# EAGLE design bridge_rp_dlp (EAGLE 9.6.2)
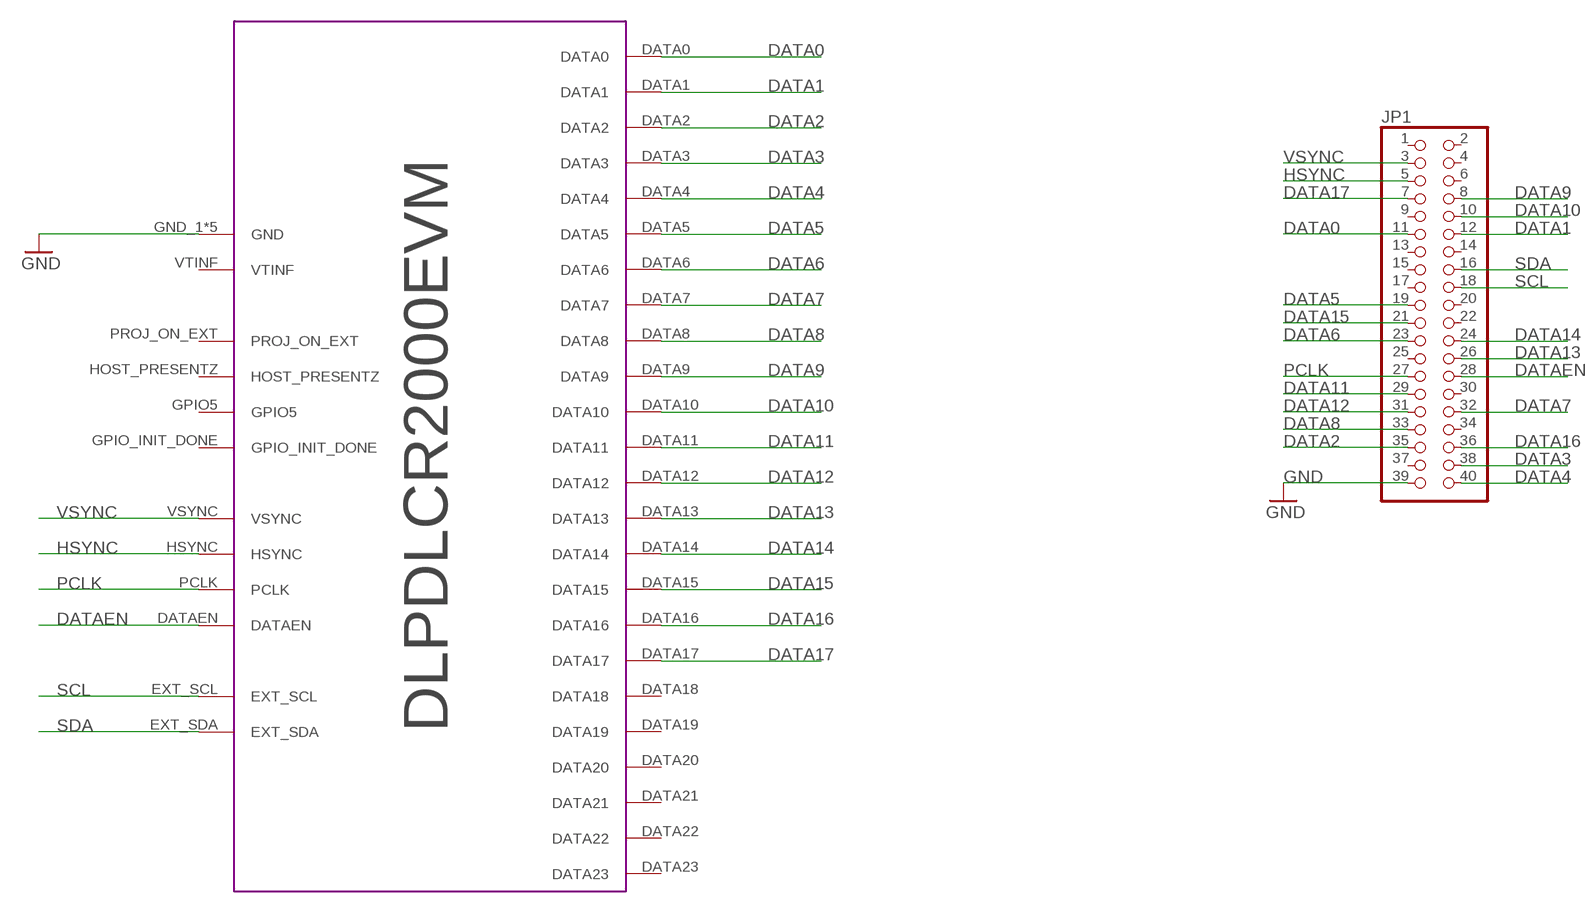
[diagram p0: schematic, sheet 1]

## Parts
JP1  PINHD-2X20  [2X20]
U$1  DLPDLCR2000EVM  [DLPDLCR2000EVM]

## Nets
DATA0: JP1.11 U$1.DATA0
DATA1: JP1.12 U$1.DATA1
DATA2: JP1.35 U$1.DATA2
DATA3: JP1.38 U$1.DATA3
DATA4: JP1.40 U$1.DATA4
DATA5: JP1.19 U$1.DATA5
DATA6: JP1.23 U$1.DATA6
DATA7: JP1.32 U$1.DATA7
DATA8: JP1.33 U$1.DATA8
DATA9: JP1.8 U$1.DATA9
DATA10: JP1.10 U$1.DATA10
DATA11: JP1.29 U$1.DATA11
DATA12: JP1.31 U$1.DATA12
DATA13: JP1.26 U$1.DATA13
DATA14: JP1.24 U$1.DATA14
DATA15: JP1.21 U$1.DATA15
DATA16: JP1.36 U$1.DATA16
DATA17: JP1.7 U$1.DATA17
DATAEN: JP1.28 U$1.DATAEN
GND: JP1.39 U$1.GND_1(GND) U$1.GND_2(GND) U$1.GND_3(GND) U$1.GND_4(GND) U$1.GND_5(GND)
HSYNC: JP1.5 U$1.HSYNC
PCLK: JP1.27 U$1.PCLK
SCL: JP1.18 U$1.EXT_SCL
SDA: JP1.16 U$1.EXT_SDA
VSYNC: JP1.3 U$1.VSYNC
Unconnected: JP1.1 JP1.2 JP1.4 JP1.6 JP1.9 JP1.13 JP1.14 JP1.15 JP1.17 JP1.20 JP1.22 JP1.25 JP1.30 JP1.34 JP1.37 U$1.DATA18 U$1.DATA19 U$1.DATA20 U$1.DATA21 U$1.DATA22 U$1.DATA23 U$1.GPIO5 U$1.GPIO_INIT_DONE U$1.HOST_PRESENTZ U$1.PROJ_ON_EXT U$1.VTINF

## Library data of the parts
JP1 = pinhead:PINHD-2X20: PIN HEADER
U$1 = DLP_lib:DLPDLCR2000EVM: The DLP® LightCrafter Display 2000 Evaluation Module (EVM) is the most affordable, compact, plug-and-play DLP display EVM for many ultra-mobile, ultra-portable display applications like mobile projectors, smart home displays, AR glasses, appliances, and robotics. This EVM features the DLP2000 (nHD) chipset, optical engine (which can be purchased separately here), and 8/16/24-bit RGB parallel video processor interface. Visit DLPDLCR230NPEVM for a higher performance EVM option that features 1080p resolution, 100lm, and Raspberry Pi out of the box. https://www.ti.com/tool/DLPDLCR2000EVM

## Board
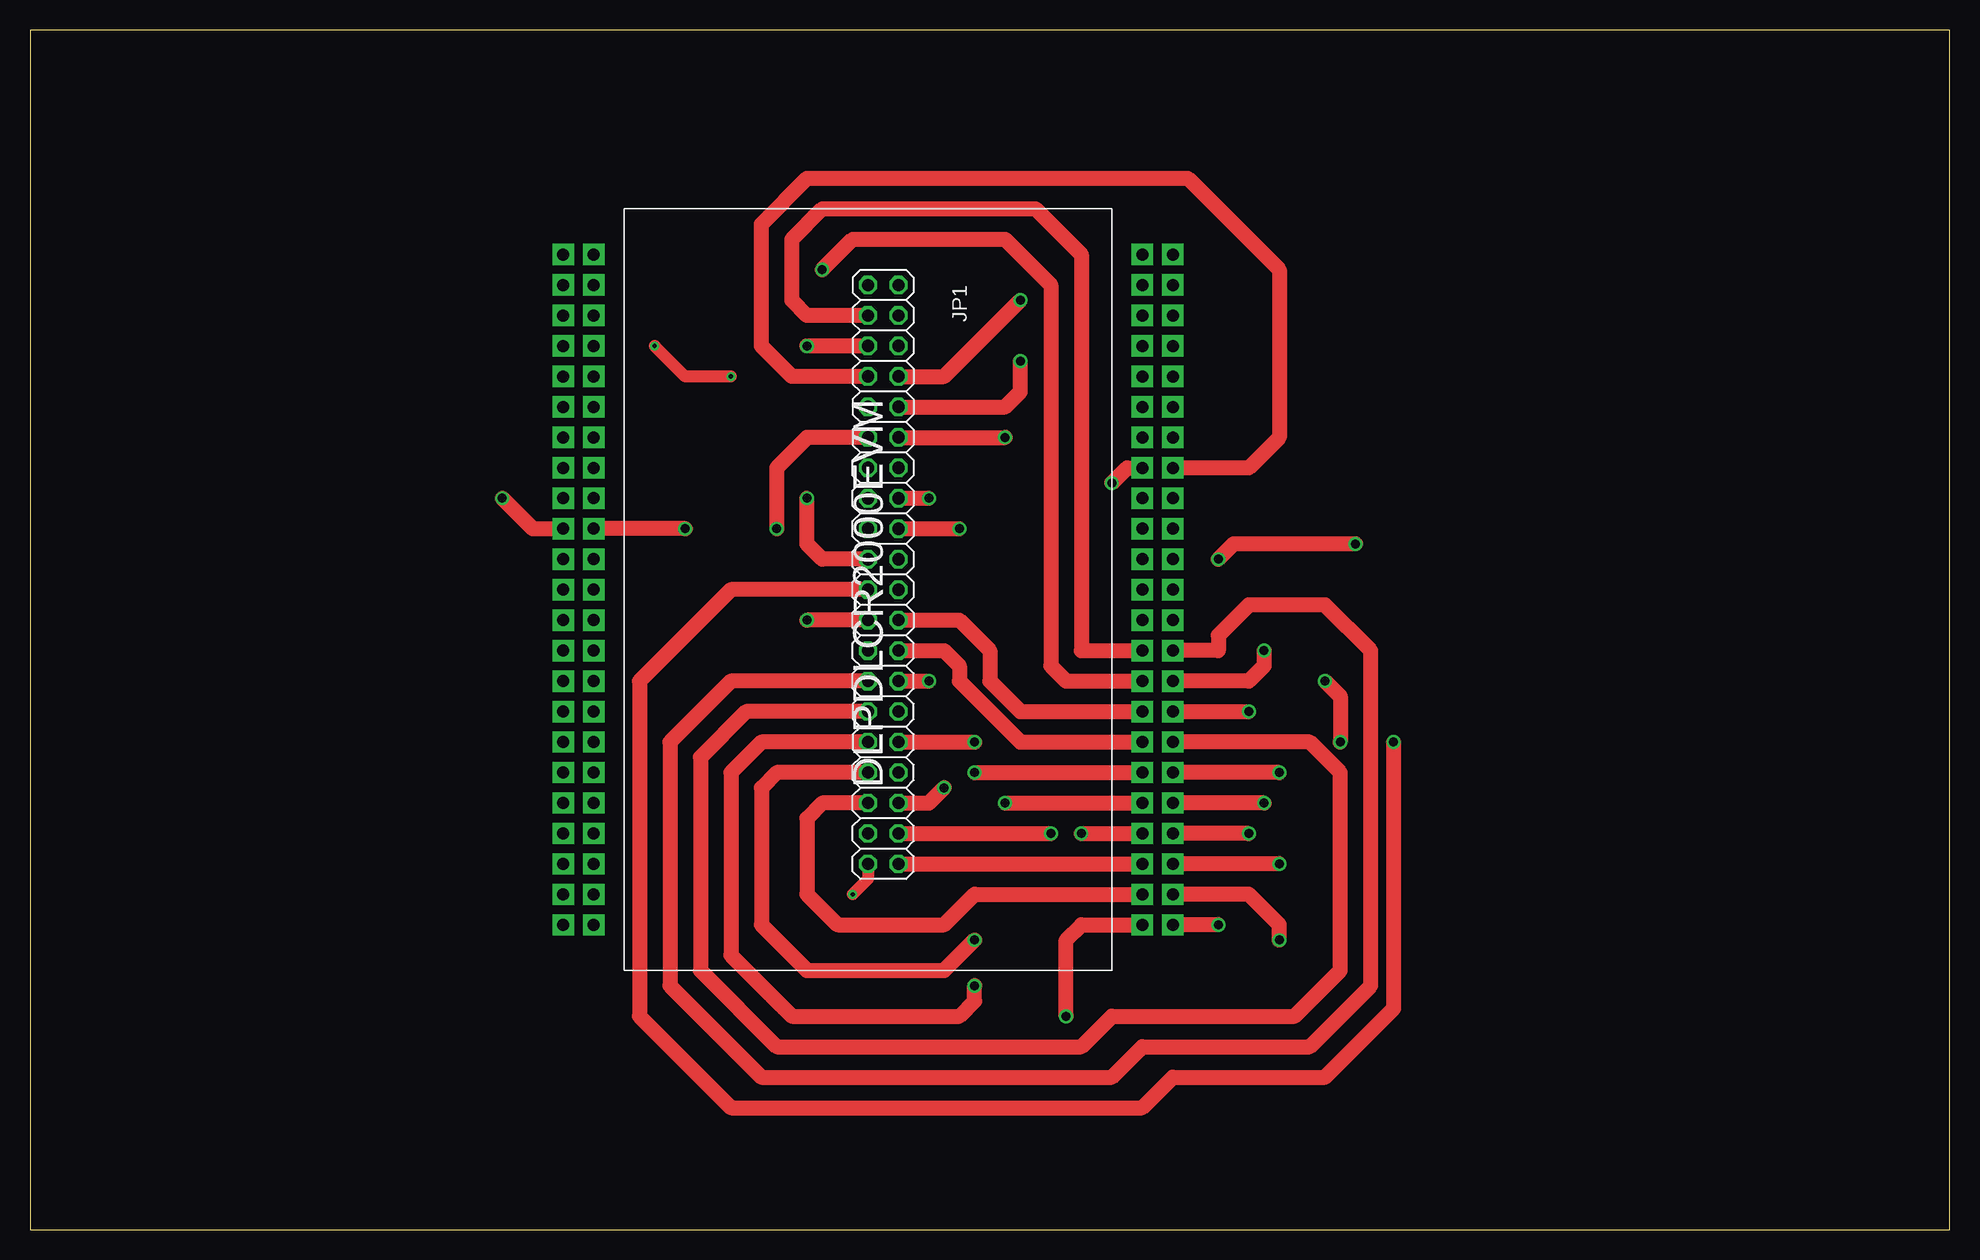
[diagram p1: board, top side]
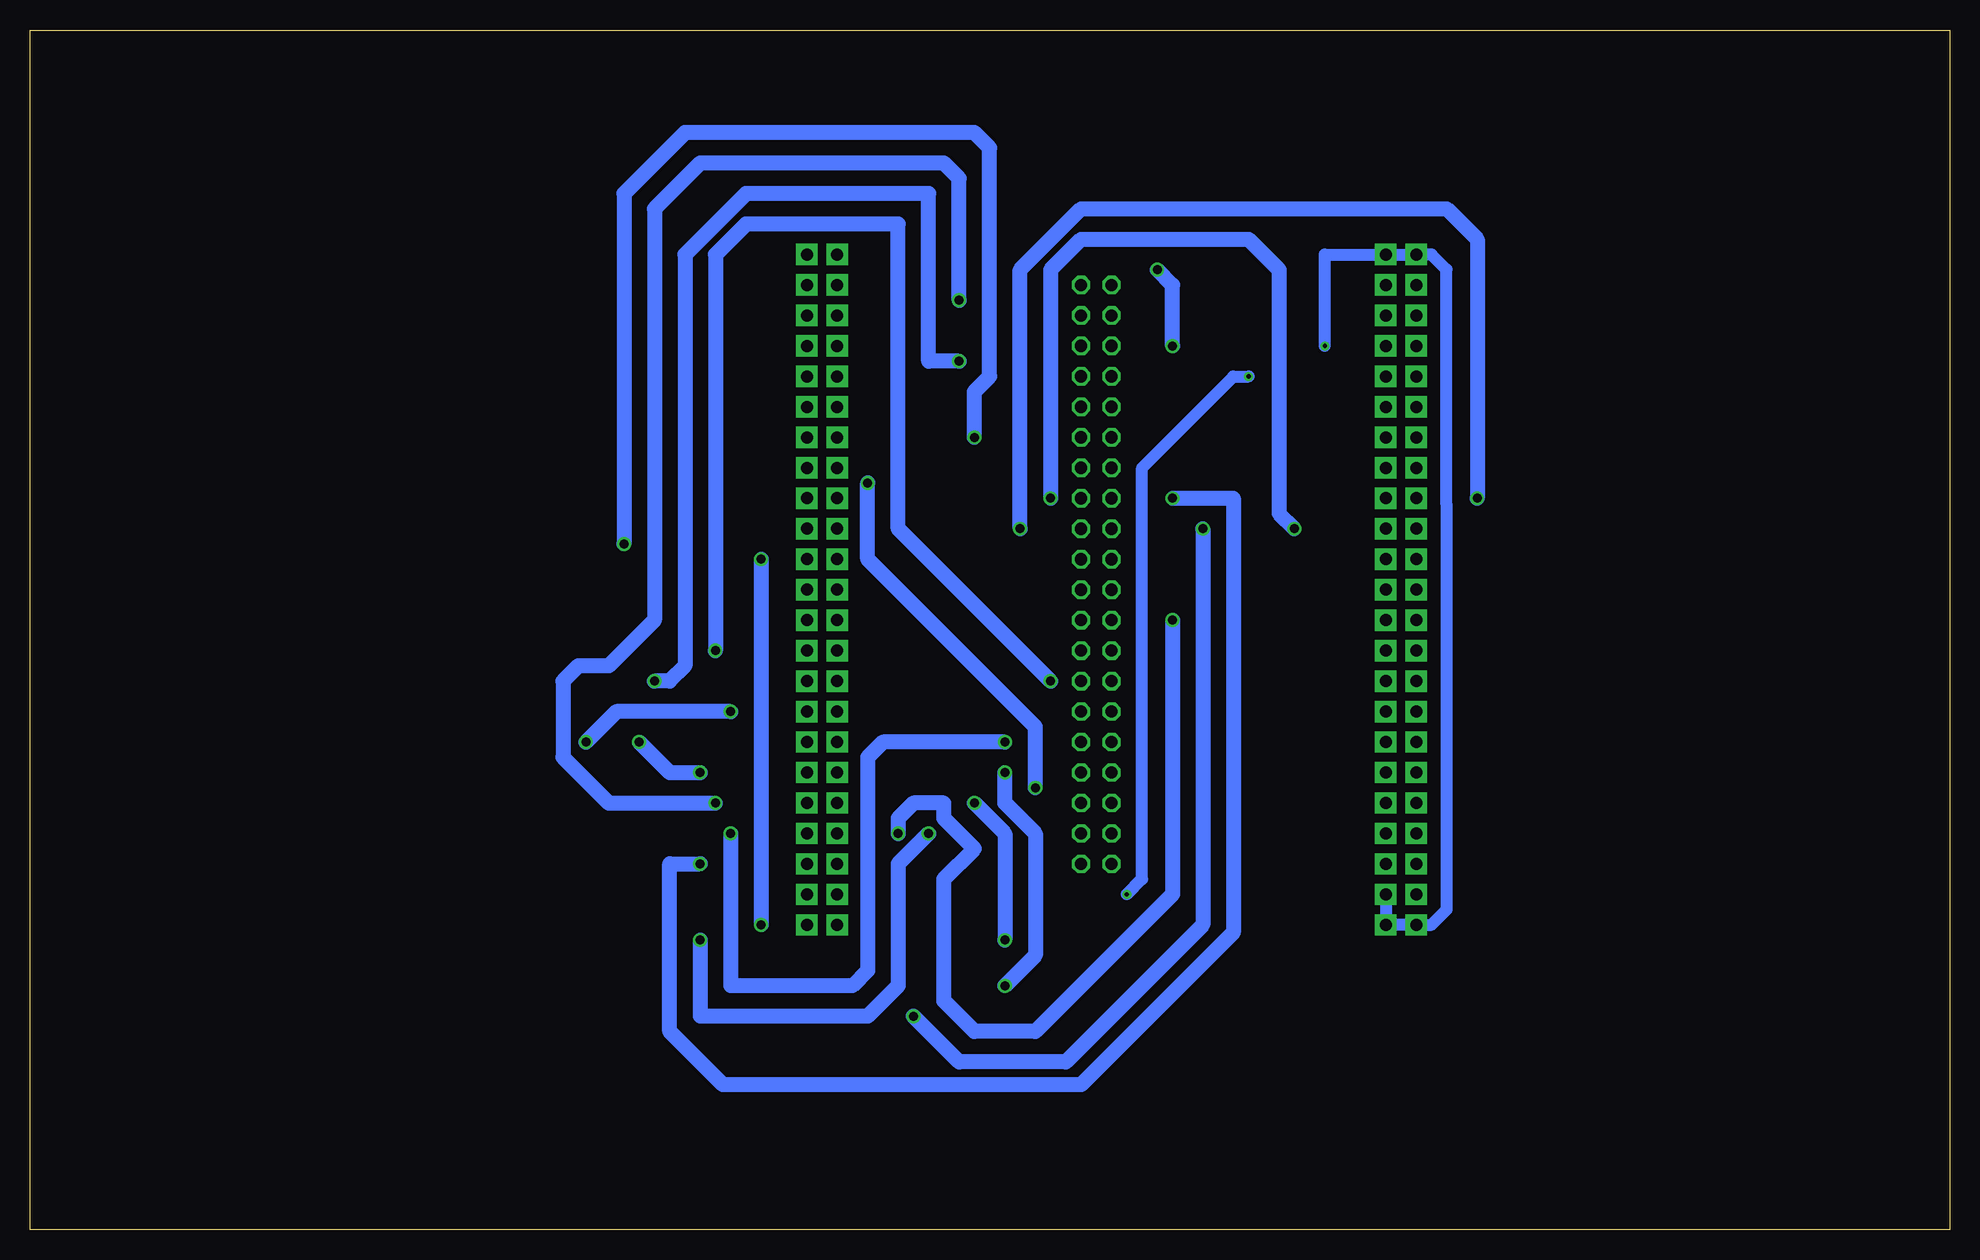
[diagram p2: board, bottom side, seen from below]

Size 160 x 100 mm. Coordinates in mm from the lower left corner, seen from the top.
Outline: 0,0 160,0 160,100 0,100 0,0
Copper layers (1*16): Top 0.035mm / dielectric 1.5mm / Bottom 0.035mm
Design rules "default": minimum track width 6mil, minimum drill 0.35mm, track to track 6mil, track to pad 6mil, pad to pad 6mil, via to via 6mil, smd to smd 6mil, copper to edge 40mil, drill to drill 6mil, minimum pad ring 10mil, minimum via ring 8mil, stop-mask expansion 4mil, vias tented up to drill 0mil, thermal gap 10mil

### Footprints (pad centres in the part's own frame; a part is rotated, then mirrored left to right if it is on the bottom)
2X20 = drill 1.016 octagon: 1 -24.13,-1.27; 2 -24.13,1.27; 3 -21.59,-1.27; 4 -21.59,1.27; 5 -19.05,-1.27; 6 -19.05,1.27; 7 -16.51,-1.27; 8 -16.51,1.27; 9 -13.97,-1.27; 10 -13.97,1.27; 11 -11.43,-1.27; 12 -11.43,1.27; 13 -8.89,-1.27; 14 -8.89,1.27; 15 -6.35,-1.27; 16 -6.35,1.27; 17 -3.81,-1.27; 18 -3.81,1.27; 19 -1.27,-1.27; 20 -1.27,1.27; 21 1.27,-1.27; 22 1.27,1.27; 23 3.81,-1.27; 24 3.81,1.27; 25 6.35,-1.27; 26 6.35,1.27; 27 8.89,-1.27; 28 8.89,1.27; 29 11.43,-1.27; 30 11.43,1.27; 31 13.97,-1.27; 32 13.97,1.27; 33 16.51,-1.27; 34 16.51,1.27; 35 19.05,-1.27; 36 19.05,1.27; 37 21.59,-1.27; 38 21.59,1.27; 39 24.13,-1.27; 40 24.13,1.27
DLPDLCR2000EVM = drill 1 pad 1.778 square: DATA0 48.26,-55.88; DATA1 50.8,-55.88; DATA2 48.26,-53.34; DATA3 50.8,-53.34; DATA4 48.26,-50.8; DATA5 50.8,-50.8; DATA6 48.26,-48.26; DATA7 50.8,-48.26; DATA8 48.26,-45.72; DATA9 50.8,-45.72; DATA10 50.8,-43.18; DATA11 50.8,-40.64; DATA12 48.26,-43.18; DATA13 48.26,-40.64; DATA14 48.26,-38.1; DATA15 50.8,-38.1; DATA16 48.26,-17.78; DATA17 50.8,-17.78; DATA18 48.26,-12.7; DATA19 50.8,-12.7; DATA20 48.26,-20.32; DATA21 50.8,-15.24; DATA22 48.26,-15.24; DATA23 48.26,-22.86; DATAEN 50.8,-35.56; EXT_SCL 0,-22.86; EXT_SDA 2.54,-22.86; GND_1 0,0; GND_2 2.54,0; GND_3 2.54,-53.34; GND_4 0,-55.88; GND_5 2.54,-55.88; GPIO5 50.8,-20.32; GPIO_INIT_DONE 50.8,-30.48; HOST_PRESENTZ 0,-53.34; HSYNC 48.26,-35.56; P$4 2.54,-2.54; P$5 0,-5.08; P$6 2.54,-5.08; P$7 0,-7.62; P$8 2.54,-7.62; P$9 0,-10.16; P$10 2.54,-10.16; P$11 0,-12.7; P$12 2.54,-12.7; P$13 0,-15.24; P$14 2.54,-15.24; P$16 2.54,-17.78; P$17 0,-20.32; P$18 2.54,-20.32; P$21 0,-25.4; P$22 2.54,-25.4; P$23 0,-27.94; P$24 2.54,-27.94; P$25 0,-30.48; P$26 2.54,-30.48; P$27 0,-33.02; P$28 2.54,-33.02; P$29 0,-35.56; P$30 2.54,-35.56; P$31 0,-38.1; P$32 2.54,-38.1; P$33 0,-40.64; P$34 2.54,-40.64; P$35 0,-43.18; P$36 2.54,-43.18; P$37 0,-45.72; P$38 2.54,-45.72; P$39 0,-48.26; P$40 2.54,-48.26; P$41 0,-50.8; P$42 2.54,-50.8; P$47 48.26,0; P$48 50.8,0; P$49 48.26,-2.54; P$50 50.8,-2.54; P$51 48.26,-5.08; P$52 50.8,-5.08; P$53 48.26,-7.62; P$54 50.8,-7.62; P$55 48.26,-10.16; P$56 50.8,-10.16; P$66 50.8,-22.86; P$67 48.26,-25.4; P$68 50.8,-25.4; P$69 48.26,-27.94; P$70 50.8,-27.94; P$71 48.26,-30.48; PCLK 50.8,-33.02; PROJ_ON_EXT 0,-17.78; VSYNC 48.26,-33.02; VTINF 0,-2.54

### Placement (x,y rotation side)
JP1  71.12,54.61 270 top
U$1  44.45,81.28 0 top

### Tracks (layer width: path | path; a pad name or v marks a point on that pad's centre or on a via)
DATA0  (via drill 0.75)
  Top 1.27: JP1.11 64.77,66.04 62.23,63.5 v62.23,58.42 | U$1.DATA0 87.63,25.4 86.36,24.13 v86.36,17.78
  Bottom 1.27: v86.36,17.78 82.55,13.97 73.66,13.97 62.23,25.4 v62.23,58.42
DATA1  (via drill 0.75)
  Top 1.27: JP1.12 v81.28,66.04 | v110.49,57.15 100.33,57.15 v99.06,55.88 | v99.06,25.4 U$1.DATA1
  Bottom 1.27: v81.28,66.04 81.28,69.85 80.01,71.12 80.01,90.17 81.28,91.44 105.41,91.44 110.49,86.36 v110.49,57.15 | v99.06,55.88 v99.06,25.4
DATA2
  Top 1.27: JP1.35 66.04,35.56 64.77,34.29 64.77,27.94 67.31,25.4 76.2,25.4 78.74,27.94 U$1.DATA2
DATA3  (via drill 0.75)
  Top 1.27: JP1.38 v85.09,33.02 | v104.14,24.13 104.14,25.4 101.6,27.94 U$1.DATA3
  Bottom 1.27: v85.09,33.02 87.63,30.48 87.63,20.32 90.17,17.78 104.14,17.78 v104.14,24.13
DATA4
  Top 1.27: JP1.40 U$1.DATA4
DATA5  (via drill 0.75)
  Top 1.27: JP1.19 66.04,55.88 64.77,57.15 v64.77,60.96 | v104.14,30.48 U$1.DATA5
  Bottom 1.27: v64.77,60.96 59.69,60.96 59.69,24.77 72.39,12.06 102.23,12.06 106.68,16.51 106.68,30.48 v104.14,30.48
DATA6  (via drill 0.75)
  Top 1.27: JP1.23 v64.77,50.8 | v87.63,33.02 U$1.DATA6
  Bottom 1.27: v64.77,50.8 64.77,27.94 76.2,16.51 81.28,16.51 83.82,19.05 83.82,29.21 81.28,31.75 83.82,34.29 83.82,35.56 86.36,35.56 87.63,34.29 v87.63,33.02
DATA7  (via drill 0.75)
  Top 1.27: JP1.32 v78.74,40.64 | v101.6,33.02 U$1.DATA7
  Bottom 1.27: v78.74,40.64 88.9,40.64 90.17,39.37 90.17,21.59 91.44,20.32 101.6,20.32 v101.6,33.02
DATA8  (via drill 0.75)
  Top 1.27: JP1.33 62.23,38.1 60.96,36.83 60.96,25.4 64.77,21.59 76.2,21.59 v78.74,24.13 | v81.28,35.56 U$1.DATA8
  Bottom 1.27: v78.74,24.13 78.74,33.02 v81.28,35.56
DATA9  (via drill 0.75)
  Top 1.27: JP1.8 76.2,71.12 v82.55,77.47 | v102.87,35.56 U$1.DATA9
  Bottom 1.27: v82.55,77.47 82.55,87.63 83.82,88.9 104.14,88.9 107.95,85.09 107.95,50.8 111.76,46.99 114.3,46.99 115.57,45.72 115.57,39.37 111.76,35.56 v102.87,35.56
DATA10  (via drill 0.75)
  Top 1.27: JP1.10 81.28,68.58 82.55,69.85 v82.55,72.39 | v107.95,45.72 109.22,44.45 v109.22,40.64 | v104.14,38.1 U$1.DATA10
  Bottom 1.27: v107.95,45.72 106.68,45.72 105.41,46.99 105.41,81.28 100.33,86.36 85.09,86.36 85.09,72.39 v82.55,72.39 | v109.22,40.64 106.68,38.1 v104.14,38.1
DATA11
  Top 1.27: JP1.29 59.69,43.18 55.88,39.37 55.88,21.59 62.23,15.24 87.63,15.24 90.17,17.78 105.41,17.78 109.22,21.59 109.22,38.1 106.68,40.64 U$1.DATA11
DATA12  (via drill 0.75)
  Top 1.27: JP1.31 60.96,40.64 58.42,38.1 58.42,22.86 63.5,17.78 77.47,17.78 78.74,19.05 v78.74,20.32 | v78.74,38.1 U$1.DATA12
  Bottom 1.27: v78.74,20.32 76.2,22.86 76.2,33.02 78.74,35.56 v78.74,38.1
DATA13
  Top 1.27: JP1.26 76.2,48.26 77.47,46.99 77.47,45.72 82.55,40.64 U$1.DATA13
DATA14
  Top 1.27: JP1.24 77.47,50.8 80.01,48.26 80.01,45.72 82.55,43.18 U$1.DATA14
DATA15  (via drill 0.75)
  Top 1.27: JP1.21 58.42,53.34 50.8,45.72 50.8,17.78 58.42,10.16 92.71,10.16 95.25,12.7 107.95,12.7 113.67,18.41 v113.67,40.64 | U$1.DATA15 v101.6,43.18
  Bottom 1.27: v113.67,40.64 111.12,43.18 v101.6,43.18
DATA16  (via drill 0.75)
  Top 1.27: JP1.36 74.93,35.56 v76.2,36.83 | U$1.DATA16 91.44,63.5 v90.17,62.23
  Bottom 1.27: v76.2,36.83 76.2,41.91 90.17,55.88 v90.17,62.23
DATA17
  Top 1.27: JP1.7 63.5,71.12 60.96,73.66 60.96,83.82 64.77,87.63 96.52,87.63 104.14,80.01 104.14,66.04 101.6,63.5 U$1.DATA17
DATAEN  (via drill 0.75)
  Top 1.27: JP1.28 v74.93,45.72 | v102.87,48.26 102.87,46.99 101.6,45.72 U$1.DATAEN
  Bottom 1.27: v74.93,45.72 87.63,58.42 87.63,83.82 100.33,83.82 102.87,81.28 v102.87,48.26
GND  (via drill 0.35)
  Top 1.016: JP1.39 69.85,29.21 v68.58,27.94 | v58.42,71.12 54.61,71.12 v52.07,73.66
  Bottom 1.016: v68.58,27.94 67.31,29.21 67.31,63.5 59.69,71.12 v58.42,71.12 | v52.07,73.66 52.07,81.28 U$1.GND_2 U$1.GND_1 43.18,81.28 41.94,80.03 41.94,60.42 41.91,60.4 41.91,26.67 43.18,25.4 U$1.GND_4 U$1.GND_5 U$1.GND_3
HSYNC  (via drill 0.75)
  Top 1.27: JP1.5 v64.77,73.66 | v66.04,80.01 68.58,82.55 81.28,82.55 85.09,78.74 85.09,46.99 86.36,45.72 U$1.HSYNC
  Bottom 1.27: v64.77,73.66 64.77,78.74 v66.04,80.01
PCLK
  Top 1.27: U$1.PCLK 99.06,48.26 99.06,49.53 101.6,52.07 107.95,52.07 111.76,48.26 111.76,20.32 106.68,15.24 92.71,15.24 90.17,12.7 60.96,12.7 53.34,20.32 53.34,40.64 58.42,45.72 JP1.27
SCL  (via drill 0.75)
  Top 1.27: v39.37,60.96 41.91,58.42 U$1.EXT_SCL | JP1.18 v77.47,58.42
  Bottom 1.27: v77.47,58.42 77.47,80.01 72.39,85.09 41.91,85.09 39.37,82.55 v39.37,60.96
SDA  (via drill 0.75)
  Top 1.27: v54.61,58.42 U$1.EXT_SDA | JP1.16 v74.93,60.96
  Bottom 1.27: v74.93,60.96 74.93,80.01 72.39,82.55 58.42,82.55 55.88,80.01 55.88,59.69 v54.61,58.42
VSYNC
  Top 1.27: JP1.3 64.77,76.2 63.5,77.47 63.5,82.55 66.04,85.09 83.82,85.09 87.63,81.28 87.63,48.26 U$1.VSYNC